# Altium project PCB_Instrumentacion.PrjPcb
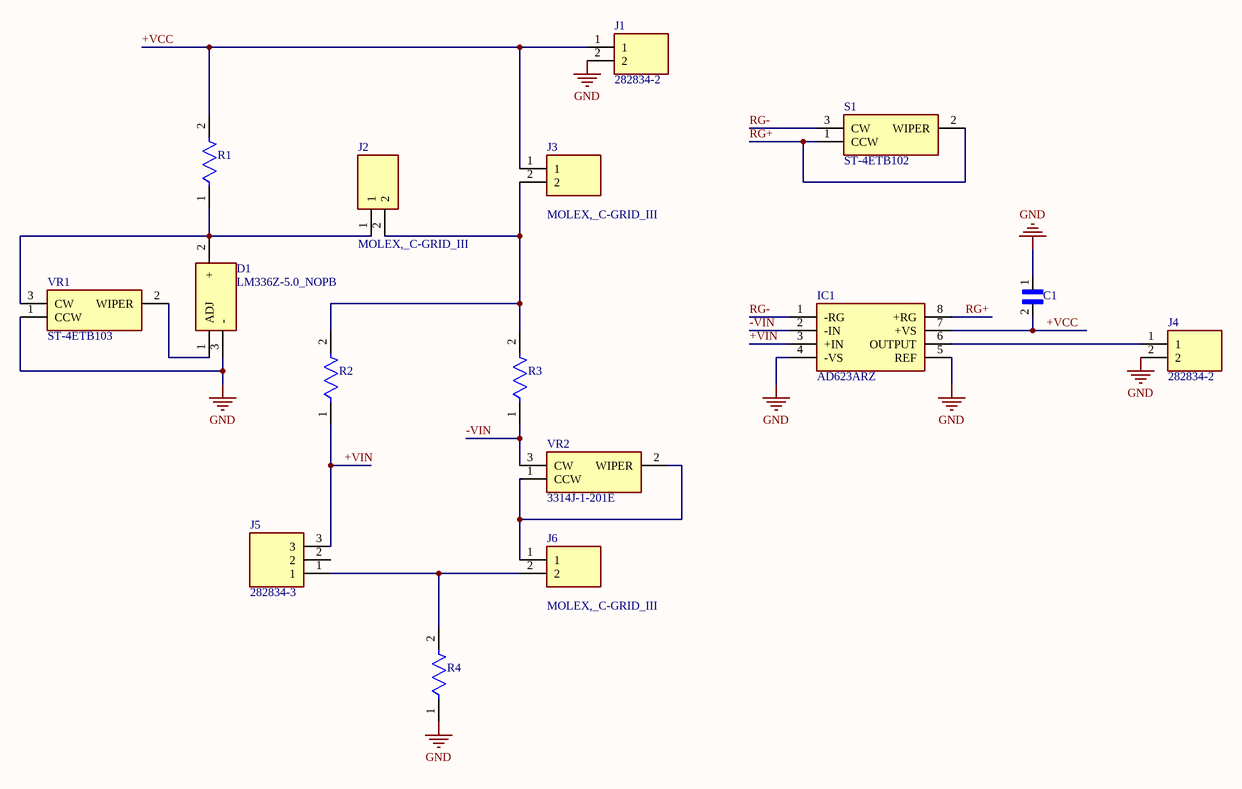
[diagram p0: Sheet1.SchDoc]
1 sheet, 16 parts. Net scope: global (net labels, ports and power ports of the same name join across sheets).
Board file: PCB1.PcbDoc

## Sheet Sheet1.SchDoc
size A4; SheetNumber: 1; SheetTotal: 1

### Parts
C1  Ceramic_Capacitor  [0603]  (value not drawn)
D1  LM336Z-5.0_NOPB  [LM336Z50NOPB]
IC1  AD623ARZ  [SOIC127P600X175-8N]
J1  282834-2  [282834-2_1]
J2  MOLEX,_C-GRID_III  [HDRV8W65P0X254_1X8_2010X249X945P]
J3  MOLEX,_C-GRID_III  [HDRV8W65P0X254_1X8_2010X249X945P]
J4  282834-2  [282834-2_1]
J5  282834-3  [2828343]
J6  MOLEX,_C-GRID_III  [HDRV8W65P0X254_1X8_2010X249X945P]
R1  Resistor  [0603]  (value not drawn)
R2  Resistor  [0603]  (value not drawn)
R3  Resistor  [0603]  (value not drawn)
R4  Resistor  [0603]  (value not drawn)
S1  ST-4ETB102  [ST4ETB102]
VR1  ST-4ETB103  [ST4ETB103]
VR2  3314J-1-201E  [3314J1201E]

### Nets
GND: C1.1 D1.3(-) IC1.4(-VS) IC1.5(REF) J1.2 J4.2 R4.1 VR1.1(CCW)
+VCC: C1.2 IC1.7(+VS) J1.1 J3.1 R1.2
+VIN: IC1.3(+IN) J5.3 R2.1
-VIN: IC1.2(-IN) R3.1 VR2.3(CW)
RG+: IC1.8(+RG) S1.1(CCW) S1.2(WIPER)
RG-: IC1.1(-RG) S1.3(CW)
NetD1_1: D1.1(ADJ) VR1.2(WIPER)
NetD1_2: D1.2(+) J2.1 R1.1 VR1.3(CW)
NetIC1_6: IC1.6(OUTPUT) J4.1
NetJ2_2: J2.2 J3.2 R2.2 R3.2
NetJ5_1: J5.1 J6.2 R4.2
NetJ6_1: J6.1 VR2.1(CCW) VR2.2(WIPER)

Not connected (* = marked no-connect by the designer): J5 2

### Library data of the parts
C1 = Ceramic_Capacitor: 0.1 µF ±10% 50V Capacitores cerámicos X7R 0603 (1608 métrico); Manufacturer: Samsung; Manufacturer Part number: CL10B104KB8NNNC; Package: None; Price: None; Value: *; Availability: Unavailable
D1 = LM336Z-5.0_NOPB: Diode; Manufacturer: Texas Instruments; Manufacturer Part number: LM336Z-5.0/NOPB; Datasheet Link: https://datasheet.datasheetarchive.com/originals/distributors/Datasheets-SFU2/DSASFU100037156.pdf; Height: 4mm; Mouser Part Number: 926-LM336Z-50/NOPB; Mouser Price/Stock: https://www.mouser.co.uk/ProductDetail/Texas-Instruments/LM336Z-5.0-NOPB?qs=X1J7HmVL2ZHN7YUiEmoZyA%3D%3D; Arrow Part Number: LM336Z-5.0/NOPB; Arrow Price/Stock: https://www.arrow.com/en/products/lm336z-5.0nopb/texas-instruments?region=nac
IC1 = AD623ARZ: Integrated Circuit; Manufacturer: Analog Devices; Datasheet Link: http://uk.rs-online.com/web/p/products/8065522; Height: 1.75mm; Manufacturer Part number: AD623ARZ; Mouser Part Number: 584-AD623ARZ; Mouser Price/Stock: https://www.mouser.co.uk/ProductDetail/Analog-Devices/AD623ARZ?qs=NmRFExCfTkGK6FtzXpd45Q%3D%3D; Arrow Part Number: AD623ARZ; Arrow Price/Stock: https://www.arrow.com/en/products/ad623arz/analog-devices?region=nac
J1 J4 = 282834-2: Connector; Manufacturer: TE Connectivity; Datasheet Link: https://www.te.com/commerce/DocumentDelivery/DDEController?Action=srchrtrv&DocNm=1-1773458-1_EURO_STYLE_QRG&DocType=Data+Sheet&DocLang=English&PartCntxt=282834-2&DocFormat=pdf; Manufacturer Part number: 282834-2; Mouser Part Number: 571-282834-2; Mouser Price/Stock: https://www.mouser.co.uk/ProductDetail/TE-Connectivity/282834-2?qs=A%252Bip%252BNCYi6N8cVKuk8xDog%3D%3D; Arrow Part Number: 282834-2; Arrow Price/Stock: https://www.arrow.com/en/products/282834-2/te-connectivity?region=europe
J2 J3 J6 = MOLEX,_C-GRID_III,_90120,_8_WAY,_1_ROW,_STRAIGHT_PIN_HEADER: Connector; Datasheet Link: https://www.molex.com/pdm_docs/sd/901200128_sd.pdf; Height: 9.45mm
J5 = 282834-3: Connector; Manufacturer: TE Connectivity; Datasheet Link: https://www.te.com/commerce/DocumentDelivery/DDEController?Action=showdoc&DocId=Customer+Drawing%7F282834%7FC1%7Fpdf%7FEnglish%7FENG_CD_282834_C1.pdf%7F282834-3; Height: 10mm; Manufacturer Part number: 282834-3; Mouser Part Number: 571-2828343; Mouser Price/Stock: https://www.mouser.co.uk/ProductDetail/TE-Connectivity/282834-3?qs=A%252Bip%252BNCYi6M69kAjqV38yA%3D%3D; Arrow Part Number: 282834-3; Arrow Price/Stock: https://www.arrow.com/en/products/282834-3/te-connectivity?region=europe
R1 R4 = Resistor: Manufacturer: Yageo; Manufacturer Part number: RC0603FR-071K2L
R2 R3 = Resistor: Manufacturer: Yageo; Manufacturer Part number: RC0603FR-074K7L
S1 = ST-4ETB102: Switch; Manufacturer: NIDEC COPAL; Datasheet Link: https://www.mouser.com/datasheet/2/972/st_4-1827515.pdf; Height: 2.45mm; Manufacturer Part number: ST-4ETB102; Mouser Part Number: 229-ST-4ETB102; Mouser Price/Stock: https://www.mouser.co.uk/ProductDetail/Nidec-Copal/ST-4ETB102?qs=XeJtXLiO41QhX9uihnXhqQ%3D%3D
VR1 = ST-4ETB103: Variable Resistor; Manufacturer: NIDEC COPAL; Datasheet Link: https://www.nidec-copal-electronics.com/e/catalog/trimmer/st-4.pdf; Height: 2.6mm; Manufacturer Part number: ST-4ETB103; Mouser Part Number: 229-ST-4ETB103; Mouser Price/Stock: https://www.mouser.co.uk/ProductDetail/Nidec-Copal/ST-4ETB103?qs=XeJtXLiO41S8fGnbwPrKRA%3D%3D
VR2 = 3314J-1-201E: Variable Resistor; Manufacturer: Bourns; Datasheet Link: https://www.bourns.com/docs/Product-Datasheets/3314.pdf; Height: 2.55mm; Manufacturer Part number: 3314J-1-201E; Mouser Part Number: 652-3314J-1-201E; Mouser Price/Stock: https://www.mouser.com/Search/Refine.aspx?Keyword=652-3314J-1-201E; Arrow Part Number: 3314J-1-201E; Arrow Price/Stock: https://www.arrow.com/en/products/3314j-1-201e/bourns?region=europe